# Altium schematic sheet Sheet2.SchDoc
size 840 x 594 mm; Address1: Address1; Address2: Address2; Address3: Address3; Address4: Address4; DocumentNumber: АБВГ.123456.001 Э3; SheetNumber: 1; Scale: 1:1; DocumentType: Схема электрическая принципиальная; FirstReferrence: АБВГ.123456.001
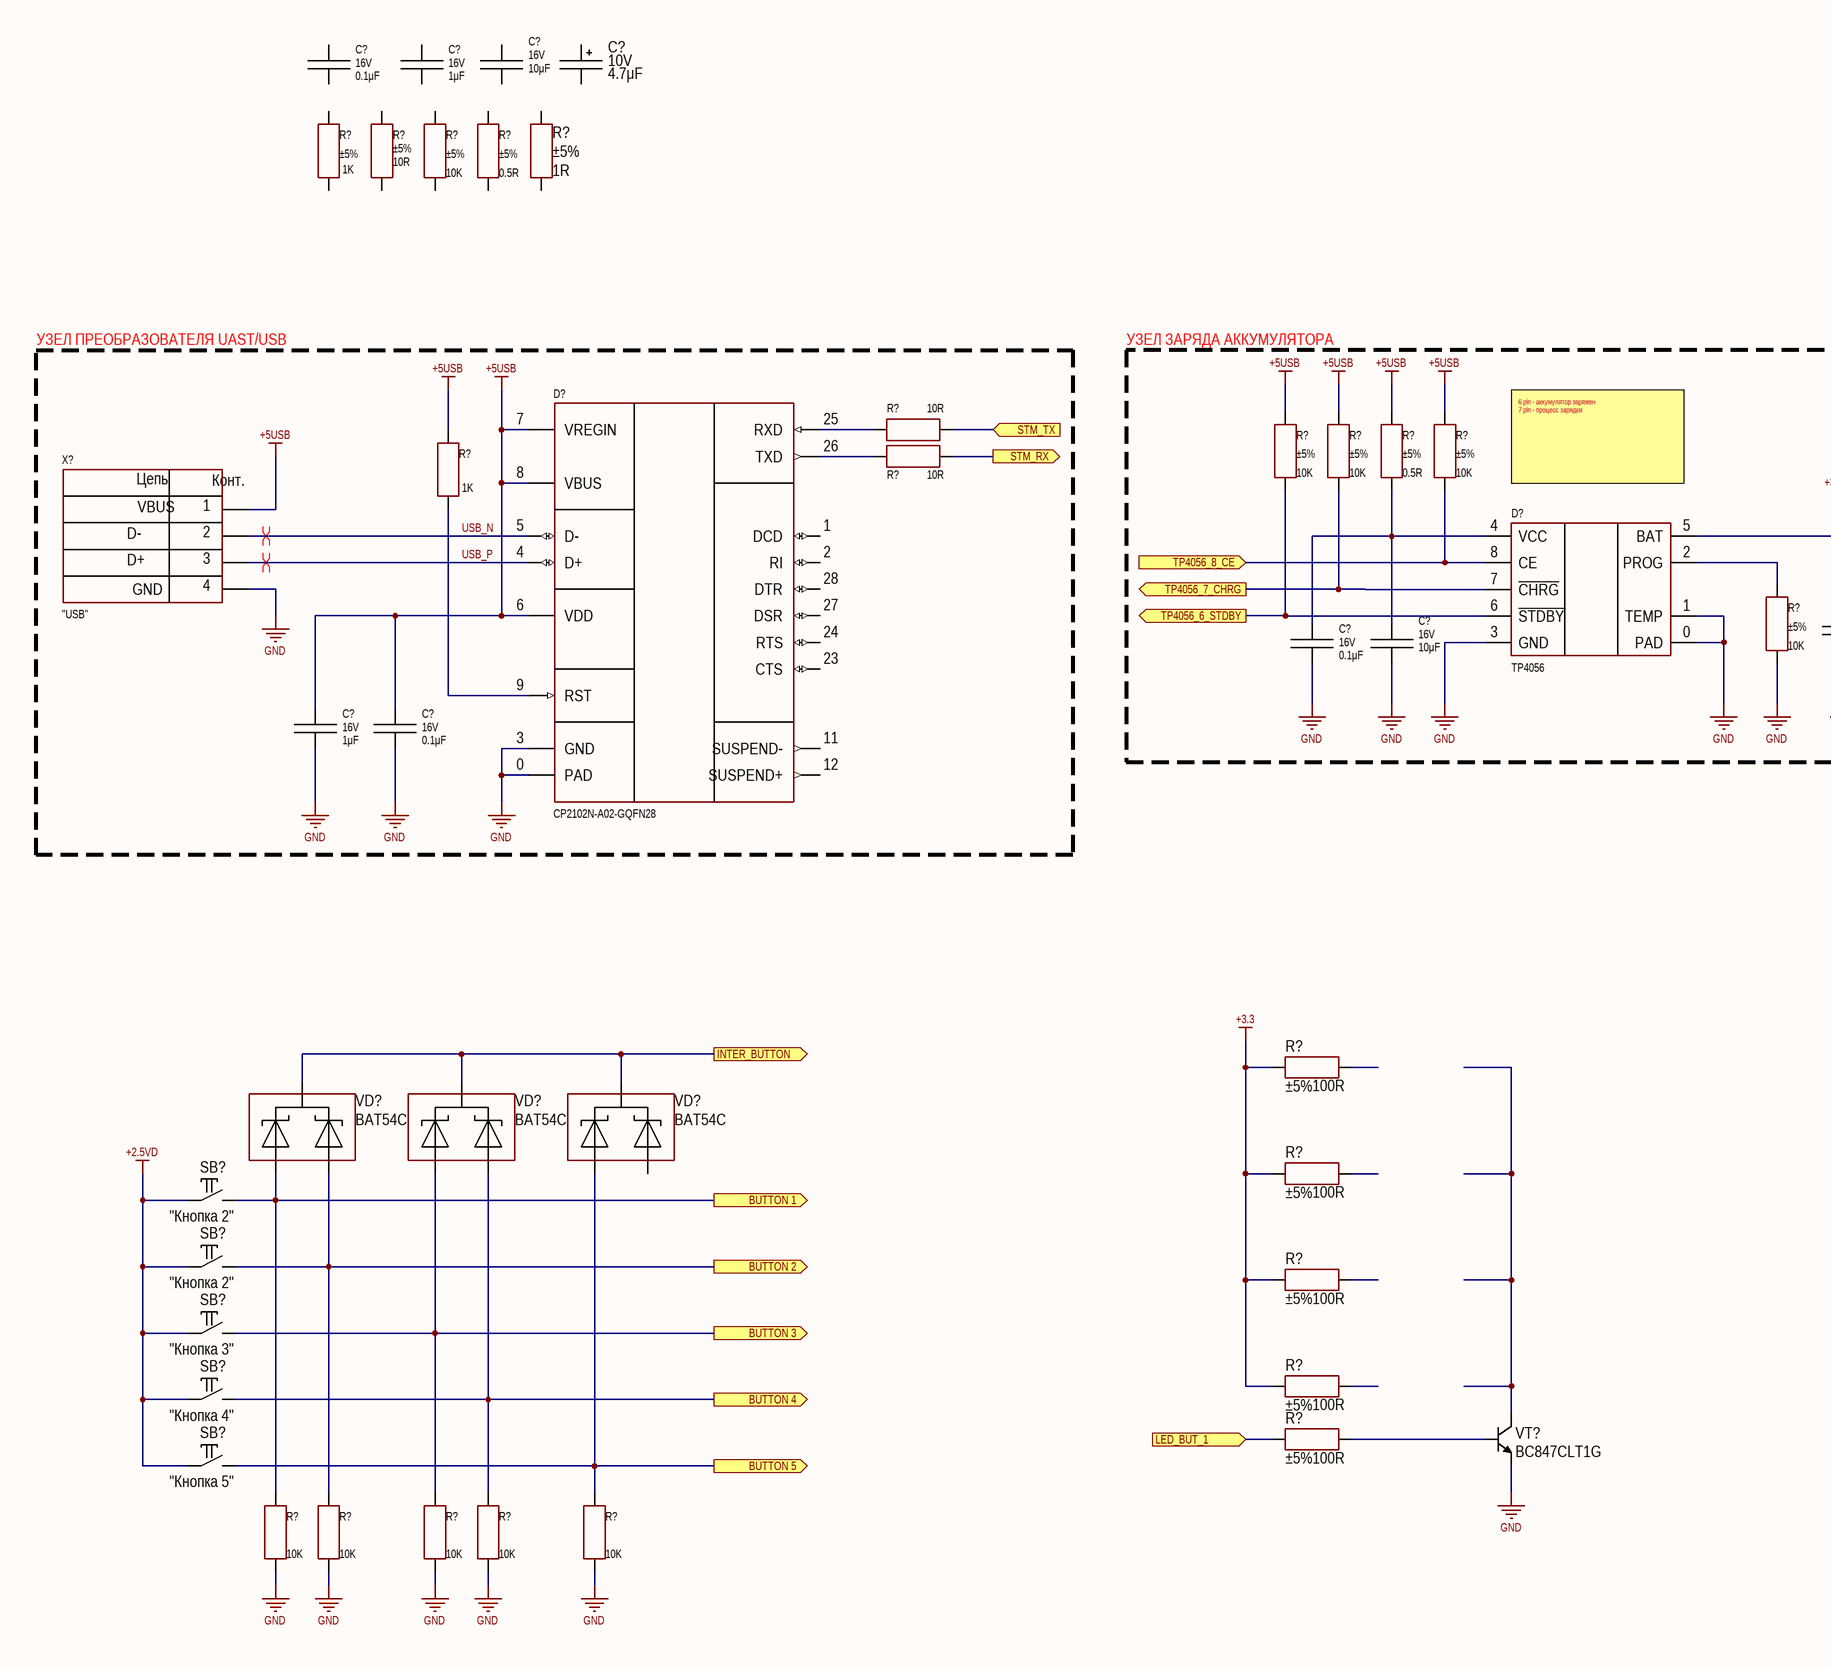
[diagram p0: Sheet2.SchDoc, left]
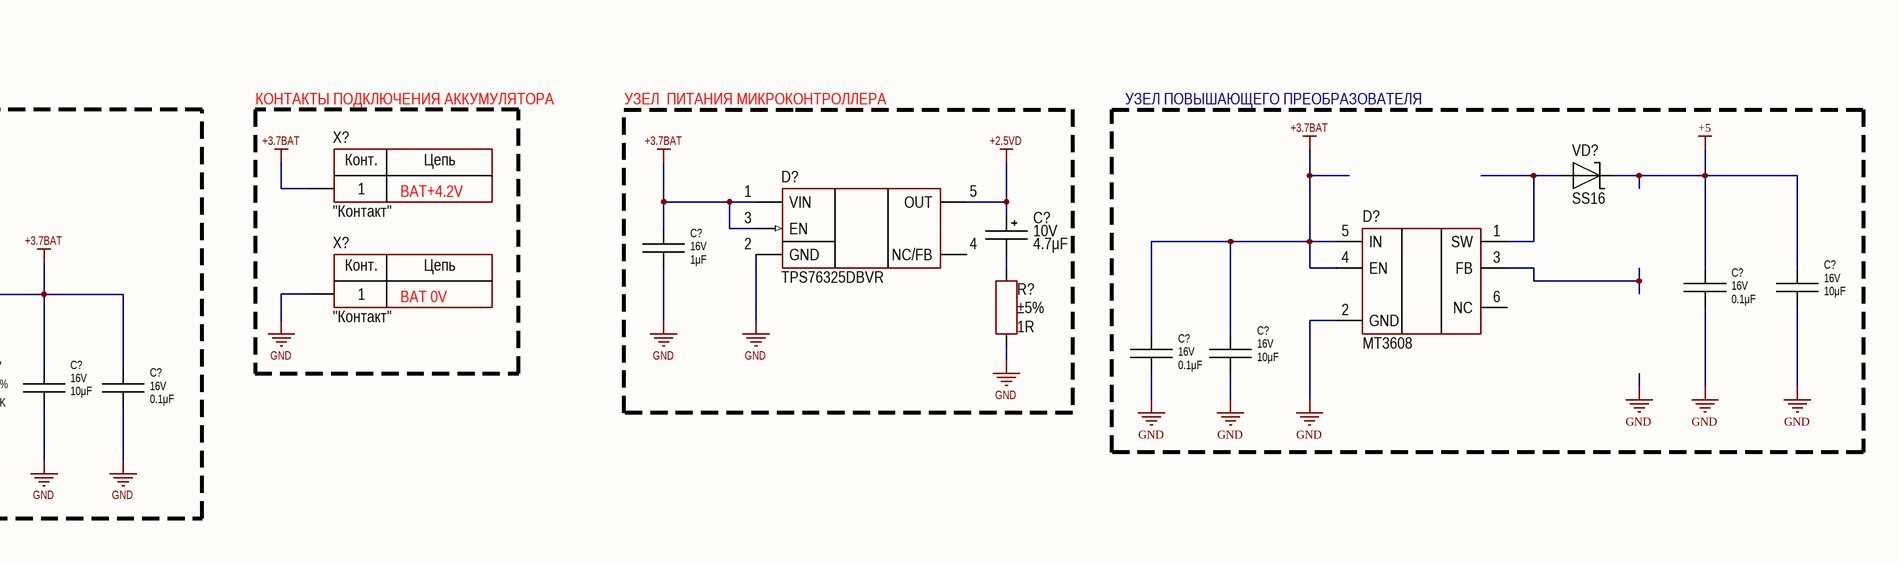
[diagram p1: Sheet2.SchDoc, right]

## Parts
(Parts that share a designator on the sheet are numbered #1, #2 ... from top to bottom, then left to right.)
C?#1  value 0.1μF  Voltage: 16V  [CAP: 0603]
C?#2  value 1μF  Voltage: 16V  [CAP: 0603]
C?#3  value 10μF  Voltage: 16V  [CAP: 0603]
C?#4  value 4.7μF  Voltage: 10V  [CAP: TANTAL-A]
C?#5  value 4.7μF  Voltage: 10V  [CAP: TANTAL-A]
C?#6  value 1μF  Voltage: 16V  [CAP: 0603]
C?#7  value 0.1μF  Voltage: 16V  [CAP: 0603]
C?#8  value 10μF  Voltage: 16V  [CAP: 0603]
C?#9  value 0.1μF  Voltage: 16V  [CAP: 0603]
C?#10  value 10μF  Voltage: 16V  [CAP: 0603]
C?#11  value 10μF  Voltage: 16V  [CAP: 0603]
C?#12  value 0.1μF  Voltage: 16V  [CAP: 0603]
C?#13  value 0.1μF  Voltage: 16V  [CAP: 0603]
C?#14  value 10μF  Voltage: 16V  [CAP: 0603]
C?#15  value 1μF  Voltage: 16V  [CAP: 0603]
C?#16  value 0.1μF  Voltage: 16V  [CAP: 0603]
D?#1  PartNumber: CP2102N-A02-GQFN28  [28-QFN (5x5)]
D?#2  (no value)  [SOT23-5]
D?#3  (no value)  [SOT23-6]
D?#4  (no value)  [8-SOIC-PAD]
R?#1  value 1K  Tolerance: ±5%  [RES: 0603]
R?#2  value 10R  Tolerance: ±5%  [RES: 0603]
R?#3  value 10K  Tolerance: ±5%  [RES: 0603]
R?#4  value 0.5R  Tolerance: ±5%  [RES: 1206]
R?#5  value 1R  Tolerance: ±5%  [RES: 0603]
R?#6  value 10R  [RES: 0603]
R?#7  value 10R  [RES: 0603]
R?#8  value 10K  Tolerance: ±5%  [RES: 0603]
R?#9  value 10K  Tolerance: ±5%  [RES: 0603]
R?#10  value 0.5R  Tolerance: ±5%  [RES: 1206]
R?#11  value 10K  Tolerance: ±5%  [RES: 0603]
R?#12  value 1K  [RES: 0603]
R?#13  value 1R  Tolerance: ±5%  [RES: 0603]
R?#14  value 10K  Tolerance: ±5%  [RES: 0603]
R?#15  value 100R  Tolerance: ±5%  [RES: 0603]
R?#16  value 100R  Tolerance: ±5%  [RES: 0603]
R?#17  value 100R  Tolerance: ±5%  [RES: 0603]
R?#18  value 100R  Tolerance: ±5%  [RES: 0603]
R?#19  value 100R  Tolerance: ±5%  [RES: 0603]
R?#20  value 10K  [RES: 0603]
R?#21  value 10K  [RES: 0603]
R?#22  value 10K  [RES: 0603]
R?#23  value 10K  [RES: 0603]
R?#24  value 10K  [RES: 0603]
SB?#1  CommentText: "Кнопка 2"  [BUT: 5X5 SMD]
SB?#2  CommentText: "Кнопка 2"  [BUT: 5X5 SMD]
SB?#3  CommentText: "Кнопка 3"  [BUT: 5X5 SMD]
SB?#4  CommentText: "Кнопка 4"  [BUT: 5X5 SMD]
SB?#5  CommentText: "Кнопка 5"  [BUT: 5X5 SMD]
VD?#1  PartNumber: SS16  [DIODE: SMA]
VD?#2  PartNumber: BAT54C  [SOT23]
VD?#3  PartNumber: BAT54C  [SOT23]
VD?#4  PartNumber: BAT54C  [SOT23]
VT?  PartNumber: BC847CLT1G  [SOT23]
X?#1  CommentText: "Контакт"  [CON: Одиночный]
X?#2  CommentText: "USB"  [CON: USB B-type]
X?#3  CommentText: "Контакт"  [CON: Одиночный]

## Blocks framed on the sheet
УЗЕЛ ПРЕОБРАЗОВАТЕЛЯ UAST/USB: C?#15 C?#16 D?#1 R?#6 R?#7 R?#12 X?#2
УЗЕЛ ЗАРЯДА АККУМУЛЯТОРА: C?#11-C?#14 D?#4 R?#8-R?#11 R?#14
УЗЕЛ  ПИТАНИЯ МИКРОКОНТРОЛЛЕРА: C?#5 C?#6 D?#2 R?#13
УЗЕЛ ПОВЫШАЮЩЕГО ПРЕОБРАЗОВАТЕЛЯ: C?#7-C?#10 D?#3 VD?#1

## Ports
BUTTON 1 (out), BUTTON 2 (out), BUTTON 3 (out), BUTTON 4 (out), BUTTON 5 (out), INTER_BUTTON (out), LED_BUT_1 (in), STM_RX (out), STM_TX (in), TP4056_6_STDBY (out), TP4056_7_CHRG (out), TP4056_8_CE (in)

## Nets
+2.5VD: C?#5.1 D?#2.5(OUT) SB?#1.1 SB?#2.1 SB?#3.1 SB?#4.1 SB?#5.1
+3.3: R?#15.1 R?#16.1 R?#17.1 R?#18.1
+3.7BAT: C?#6.2 C?#9.2 C?#10.2 C?#11.2 C?#12.2 D?#2.1(VIN) D?#2.3(EN) D?#3.4(EN) D?#3.5(IN) D?#4.5(BAT) X?#1.1
+5: C?#7.2 C?#8.2 VD?#1.2
+5USB: C?#15.2 C?#16.2 D?#1.6(VDD) D?#1.7(VREGIN) D?#1.8(VBUS) R?#8.2 R?#9.2 R?#10.2 R?#11.2 R?#12.2 X?#2.1
GND: C?#6.1 C?#7.1 C?#8.1 C?#9.1 C?#10.1 C?#11.1 C?#12.1 C?#13.1 C?#14.1 C?#15.1 C?#16.1 D?#1.0(PAD) D?#1.3(GND) D?#2.2(GND) D?#3.2(GND) D?#4.0(PAD) D?#4.1(TEMP) D?#4.3(GND) R?#13.1 R?#14.1 R?#20.1 R?#21.1 R?#22.1 R?#23.1 R?#24.1 VT?.2(E) X?#2.4 X?#3.1
BUTTON 1: R?#20.2 SB?#1.2 VD?#2.1 ; port BUTTON 1
BUTTON 2: R?#21.2 SB?#2.2 VD?#2.2 ; port BUTTON 2
BUTTON 3: R?#22.2 SB?#3.2 VD?#3.1 ; port BUTTON 3
BUTTON 4: R?#23.2 SB?#4.2 VD?#3.2 ; port BUTTON 4
BUTTON 5: R?#24.2 SB?#5.2 VD?#4.1 ; port BUTTON 5
INTER_BUTTON: VD?#2.3 VD?#3.3 VD?#4.3 ; port INTER_BUTTON
LED_BUT_1: R?#19.1 ; port LED_BUT_1
STM_RX: R?#7.2 ; port STM_RX
STM_TX: R?#6.2 ; port STM_TX
TP4056_6_STDBY: D?#4.6(~{STDBY}) R?#8.1 ; port TP4056_6_STDBY
TP4056_7_CHRG: D?#4.7(~{CHRG}) R?#9.1 ; port TP4056_7_CHRG
TP4056_8_CE: D?#4.8(CE) R?#11.1 ; port TP4056_8_CE
USB_N: D?#1.5(D-) X?#2.2
USB_P: D?#1.4(D+) X?#2.3
NetC?#5_2: C?#5.2 R?#13.2
NetC?#13_2: C?#13.2 C?#14.2 D?#4.4(VCC) R?#10.1
NetD?#1_9: D?#1.9(RST) R?#12.1
NetD?#1_25: D?#1.25(RXD) R?#6.1
NetD?#1_26: D?#1.26(TXD) R?#7.1
NetD?#3_1: D?#3.1(SW) VD?#1.1
NetD?#4_2: D?#4.2(PROG) R?#14.2
NetR?#19_2: R?#19.2 VT?.1(B)

Not connected (* = marked no-connect by the designer): C?#1 1 2; C?#2 1 2; C?#3 1 2; C?#4 1 2; D?#1 1(DCD) 2(RI) 11(SUSPEND-) 12(SUSPEND+) 23(CTS) 24(RTS) 27(DSR) 28(DTR); D?#2 4(NC/FB); D?#3 3(FB) 6(NC); R?#1 1 2; R?#2 1 2; R?#3 1 2; R?#4 1 2; R?#5 1 2; R?#15 2; R?#16 2; R?#17 2; R?#18 2; VD?#4 2; VT? 3(C)

## Layout directives
differential pair: USB_N, USB_P

## Notes on the sheet
- КОНТАКТЫ ПОДКЛЮЧЕНИЯ АККУМУЛЯТОРА
- BAT+4.2V
- 6 pin - аккумулятор заряжен
  7 pin - процесс зарядки
- BAT 0V
- Перв. примен.
- Справ. №
- Подп. и дата
- Инв. № дубл.
- Взам. инв. №
- Разраб.
- Изм.
- Лист
- № докум.
- Подп.
- Дата
- Лит.
- Масса
- Масштаб
- Пров.
- Т.контр.
- Листов
- Инв. № подл.
- Утв.
- Н.контр.
- 2.106-A1
- Копировал
- Формат А1
- (in symbol Connector_USB_B-type) Цепь; Конт.; VBUS; D-; D+; GND
- (in symbol Одиночный контакт) Конт.; Цепь

## Library data of the parts
C?#1 C?#7 C?#9 C?#12 C?#13 C?#16 = Ceramic_0603: Manufacturer: Yageo; PartNumber: CC0603KRX7R7BB104; ValueManufacturerPartNumber: Ceramic capacitor, 0.1μF, X7R, ±10%, 16V, 0603, -55...+125°C; TypeCapacitor: Ceramic capacitor; Tolerance: ±10%; TypeDielectric: X7R; Package: 0603; HelpURL: https://www.digikey.com/product-detail/en/yageo/CC0603KRX7R7BB104/311-1088-1-ND/302998; Temperature: -55...+125°C
C?#2 C?#6 C?#15 = Ceramic_0603: Manufacturer: Yageo; PartNumber: CC0603KRX7R7BB104; ValueManufacturerPartNumber: Ceramic capacitor, 1μF, X7R, ±10%, 16V, 0603, -55...+125°C; TypeCapacitor: Ceramic capacitor; Tolerance: ±10%; TypeDielectric: X7R; Package: 0603; HelpURL: https://www.digikey.com/product-detail/en/yageo/CC0603KRX7R7BB104/311-1088-1-ND/302998; Temperature: -55...+125°C
C?#3 C?#8 C?#10 C?#11 C?#14 = Ceramic_0603: Manufacturer: Yageo; PartNumber: CC0603KRX7R7BB104; ValueManufacturerPartNumber: Ceramic capacitor, 10μF, X7R, ±10%, 16V, 0603, -55...+125°C; TypeCapacitor: Ceramic capacitor; Tolerance: ±10%; TypeDielectric: X7R; Package: 0603; HelpURL: https://www.digikey.com/product-detail/en/yageo/CC0603KRX7R7BB104/311-1088-1-ND/302998; Temperature: -55...+125°C
C?#4 C?#5 = Tantal_A: Manufacturer: AVX; PartNumber: F930J107KAAAJ6; ValueManufacturerPartNumber: Tantalum capacitor, 4.7μF, 10V, ±10%, 2Ohm, case A (3216), -55...+125°C; Impedance: 2Ohm; Tolerance: ±10%; TypeCapacitor: Tantalum capacitor; ChipDip: 6038; Package: case A (3216); HelpURL: https://www.chipdip.by/product/tecap-4.7-mkf-10-v-tip-a-10; Temperature: -55...+125°C
D?#1 = CP2102N: USB-to-UART; Manufacturer: Silicon Labs; ValueManufacturerPartNumber: IC usb-to-uart bridge, USB2.0, 3...3.6V, -40...+85°C, 28-VFQFN; Supply: 3...3.6V; HelpURL: https://www.digikey.com/product-detail/en/silicon-labs/CP2102N-A02-GQFN28/336-5889-ND/9863477; Package: 28-VFQFN; ComponentType: IC usb-to-uart bridge; Temperature: -40...+85°C; Standard: USB2.0
D?#2 = TPS76325DBVR: LDO регулятор напряжения, 2.5В, 150мА; Manufacturer: Texas Instruments; VoltageInput: input 10V MAX; CurrentOutput: 0.15A; VoltageOutput: output 2.5V; HelpURL: https://www.chipdip.by/product/tps76325dbvt; Package: SOT23-5; ComponentType: LDO регулятор напряжения; ValueManufacturerPartNumber: =ComponentType+', '+VoltageInput+', '+Frequency+', '+VoltageOutput+', '+CurrentOutput+', '+Temperature+', '+Package; Temperature: -40...+125°C; PartNumber: TPS76325DBVR
D?#3 = MT3608: Step Up Converter; HelpURL: https://www.olimex.com/Products/Breadboarding/BB-PWR-3608/resources/MT3608.pdf; Package: SOT23-6; ComponentType: High Efficiency 1.2MHz; ValueManufacturerPartNumber: =ComponentType+', '+VoltageInput+', '+MaxDropout+', '+VoltageOutput+', '+CurrentOutput+', '+Temperature+', '+Package; Temperature: -40...+85°C; PartNumber: MT3608
D?#4 = TP4056: Li-lon Battery Charger; CurrentOutput: 1A; HelpURL: https://dlnmh9ip6v2uc.cloudfront.net/datasheets/Prototyping/TP4056.pdf; Package: SOP-8; ComponentType: 1A Standalone Linear Li-lon Battery Charger with Thermal; ValueManufacturerPartNumber: =ComponentType+', '+VoltageInput+', '+Frequency+', '+VoltageOutput+', '+CurrentOutput+', '+Temperature+', '+Package; Temperature: -40...+85°C; PartNumber: TP4056
R?#1 = Resistor_0603: Manufacturer: Yageo; PartNumber: RC0603JR-07100RL; ValueManufacturerPartNumber: Resistor film, 1K, ±5%, 0603, 0.1W, -55...+125°C; TypeResistor: Resistor film; Power: 0.1W; Package: 0603; HelpURL: https://www.digikey.com/product-detail/en/yageo/RC0603JR-07100RL/311-100GRCT-ND/729644; Temperature: -55...+125°C
R?#2 = Resistor_0603: Manufacturer: Yageo; PartNumber: RC0603JR-07100RL; ValueManufacturerPartNumber: Resistor film, 10R, ±5%, 0603, 0.1W, -55...+125°C; TypeResistor: Resistor film; Power: 0.1W; Package: 0603; HelpURL: https://www.digikey.com/product-detail/en/yageo/RC0603JR-07100RL/311-100GRCT-ND/729644; Temperature: -55...+125°C
R?#3 R?#8 R?#9 R?#11 R?#14 = Resistor_0603: Manufacturer: Yageo; PartNumber: RC0603JR-07100RL; ValueManufacturerPartNumber: Resistor film, 10K, ±5%, 0603, 0.1W, -55...+125°C; TypeResistor: Resistor film; Power: 0.1W; Package: 0603; HelpURL: https://www.digikey.com/product-detail/en/yageo/RC0603JR-07100RL/311-100GRCT-ND/729644; Temperature: -55...+125°C
R?#4 R?#10 = Resistor_1206: Manufacturer: Yageo; PartNumber: RC1206JR-07100RL; ValueManufacturerPartNumber: Resistor film, 0.5R, ±5%, 1206, 0.25W, -55...+125°C; TypeResistor: Resistor film; Power: 0.25W; Package: 1206; HelpURL: https://www.digikey.com/product-detail/en/yageo/RC1206JR-07100RL/311-100ERCT-ND/732153; Temperature: -55...+125°C
R?#5 R?#13 = Resistor_0603: Manufacturer: Yageo; PartNumber: RC0603JR-07100RL; ValueManufacturerPartNumber: Resistor film, 1R, ±5%, 0603, 0.1W, -55...+125°C; TypeResistor: Resistor film; Power: 0.1W; Package: 0603; HelpURL: https://www.digikey.com/product-detail/en/yageo/RC0603JR-07100RL/311-100GRCT-ND/729644; Temperature: -55...+125°C
R?#6 R?#7 = Resistor_0603: Manufacturer: Yageo; PartNumber: RC0603JR-07100RL; ValueManufacturerPartNumber: Resistor film, 10R, ±5%, 0603, 0.1W, -55...+125°C; TypeResistor: Resistor film; Power: 0.1W; Tolerance: ±5%; Package: 0603; HelpURL: https://www.digikey.com/product-detail/en/yageo/RC0603JR-07100RL/311-100GRCT-ND/729644; Temperature: -55...+125°C
R?#12 = Resistor_0603: Manufacturer: Yageo; PartNumber: RC0603JR-07100RL; ValueManufacturerPartNumber: Resistor film, 1K, ±5%, 0603, 0.1W, -55...+125°C; TypeResistor: Resistor film; Power: 0.1W; Tolerance: ±5%; Package: 0603; HelpURL: https://www.digikey.com/product-detail/en/yageo/RC0603JR-07100RL/311-100GRCT-ND/729644; Temperature: -55...+125°C
R?#15-R?#19 = Resistor_0603: Manufacturer: Yageo; PartNumber: RC0603JR-07100RL; ValueManufacturerPartNumber: Resistor film, 100R, ±5%, 0603, 0.1W, -55...+125°C; TypeResistor: Resistor film; Power: 0.1W; Package: 0603; HelpURL: https://www.digikey.com/product-detail/en/yageo/RC0603JR-07100RL/311-100GRCT-ND/729644; Temperature: -55...+125°C
R?#20-R?#24 = Resistor_0603: Manufacturer: Yageo; PartNumber: RC0603JR-07100RL; ValueManufacturerPartNumber: Resistor film, 10K, ±5%, 0603, 0.1W, -55...+125°C; TypeResistor: Resistor film; Power: 0.1W; Tolerance: ±5%; Package: 0603; HelpURL: https://www.digikey.com/product-detail/en/yageo/RC0603JR-07100RL/311-100GRCT-ND/729644; Temperature: -55...+125°C
SB?#1-SB?#5 = Button_tactile: Manufacturer: TE Connectivity; ValueManufacturerPartNumber: Tactile button, 6x6mm; PartNumber: FSM2JSMAATR; TypeButton: Tactile button; HelpURL: https://www.digikey.com/product-detail/en/te-connectivity-alcoswitch-switches/FSM2JSMAATR/450-1792-1-ND/3503931; Package: 6x6mm
VD?#1 = Schottky_single: Manufacturer: Diodes Incorporated; ValueManufacturerPartNumber: Schottky diode, 60V, 1000mA, 0.75V, 90pF, SOD-123, -55...+150°C; TypeDiode: Schottky diode; Voltage: 60V; Current: 1000mA; VoltageDrop: 0.75V; RecoveryTime: 90pF; Package: SOD-123; HelpURL: https://belchip.by/sitedocs/ss10.pdf; Temperature: -55...+150°C
VD?#2-VD?#4 = BAT54С: 200mWatt, 30Volt Schottky Barrier Diode; Manufacturer: Micro Commercial Components Corp. (MCC); TypeDiode: Schottky diode; Voltage: 30V; Current: 200mA; VoltageDrop: 0.32V; RecoveryTime: 10pF; Package: SOT-23; HelpURL: https://www.chipdip.by/product/bat54c-tp-reel-3000; ValueManufacturerPartNumber: =TypeDiode+', '+Voltage+', '+Current+', '+VoltageDrop+', '+RecoveryTime+', '+Package+', '+Temperature
VT? = BJT_NPN_132: Manufacturer: ON Semiconductor; ValueManufacturerPartNumber: NPN transistor, 45V, 100mA, 100MHz, 300mW, 0.6V, 420, SOT-23, -55...+125°C; TypeTransistor: NPN transistor; VoltageCE: 45V; CurrentCE: 100mA; VoltageSaturation: 0.6V; Frequency: 100MHz; CurrentGain: 420; MaxPower: 300mW; Package: SOT-23; HelpURL: https://www.digikey.com/product-detail/en/on-semiconductor/BC847CLT1G/BC847CLT1GOSCT-ND/917836; Temperature: -55...+125°C
X?#1 X?#3 = Одиночный контакт: TypeConnector: Connector; Multichannel: 1pin; ValueManufacturerPartNumber: =TypeConnector+', '+Multichannel+', '+Pitch+', '+VoltageMax+', '+CurrentMax
X?#2 = Connector_USB_B-type: Manufacturer: On Shore Technology Inc.; ValueManufacturerPartNumber: USB B-type; PartNumber: ED2982-ND; HelpURL: https://www.digikey.com/en/products/detail/on-shore-technology-inc/USB-B1HSW6/2677743?s=N4IgTCBcDaIKoGUBCBaJBGAEgg6gNhAF0BfIA; TypeConnector: USB B-type